# EAGLE design 5977a to pcb adaptor (EAGLE 5.11)
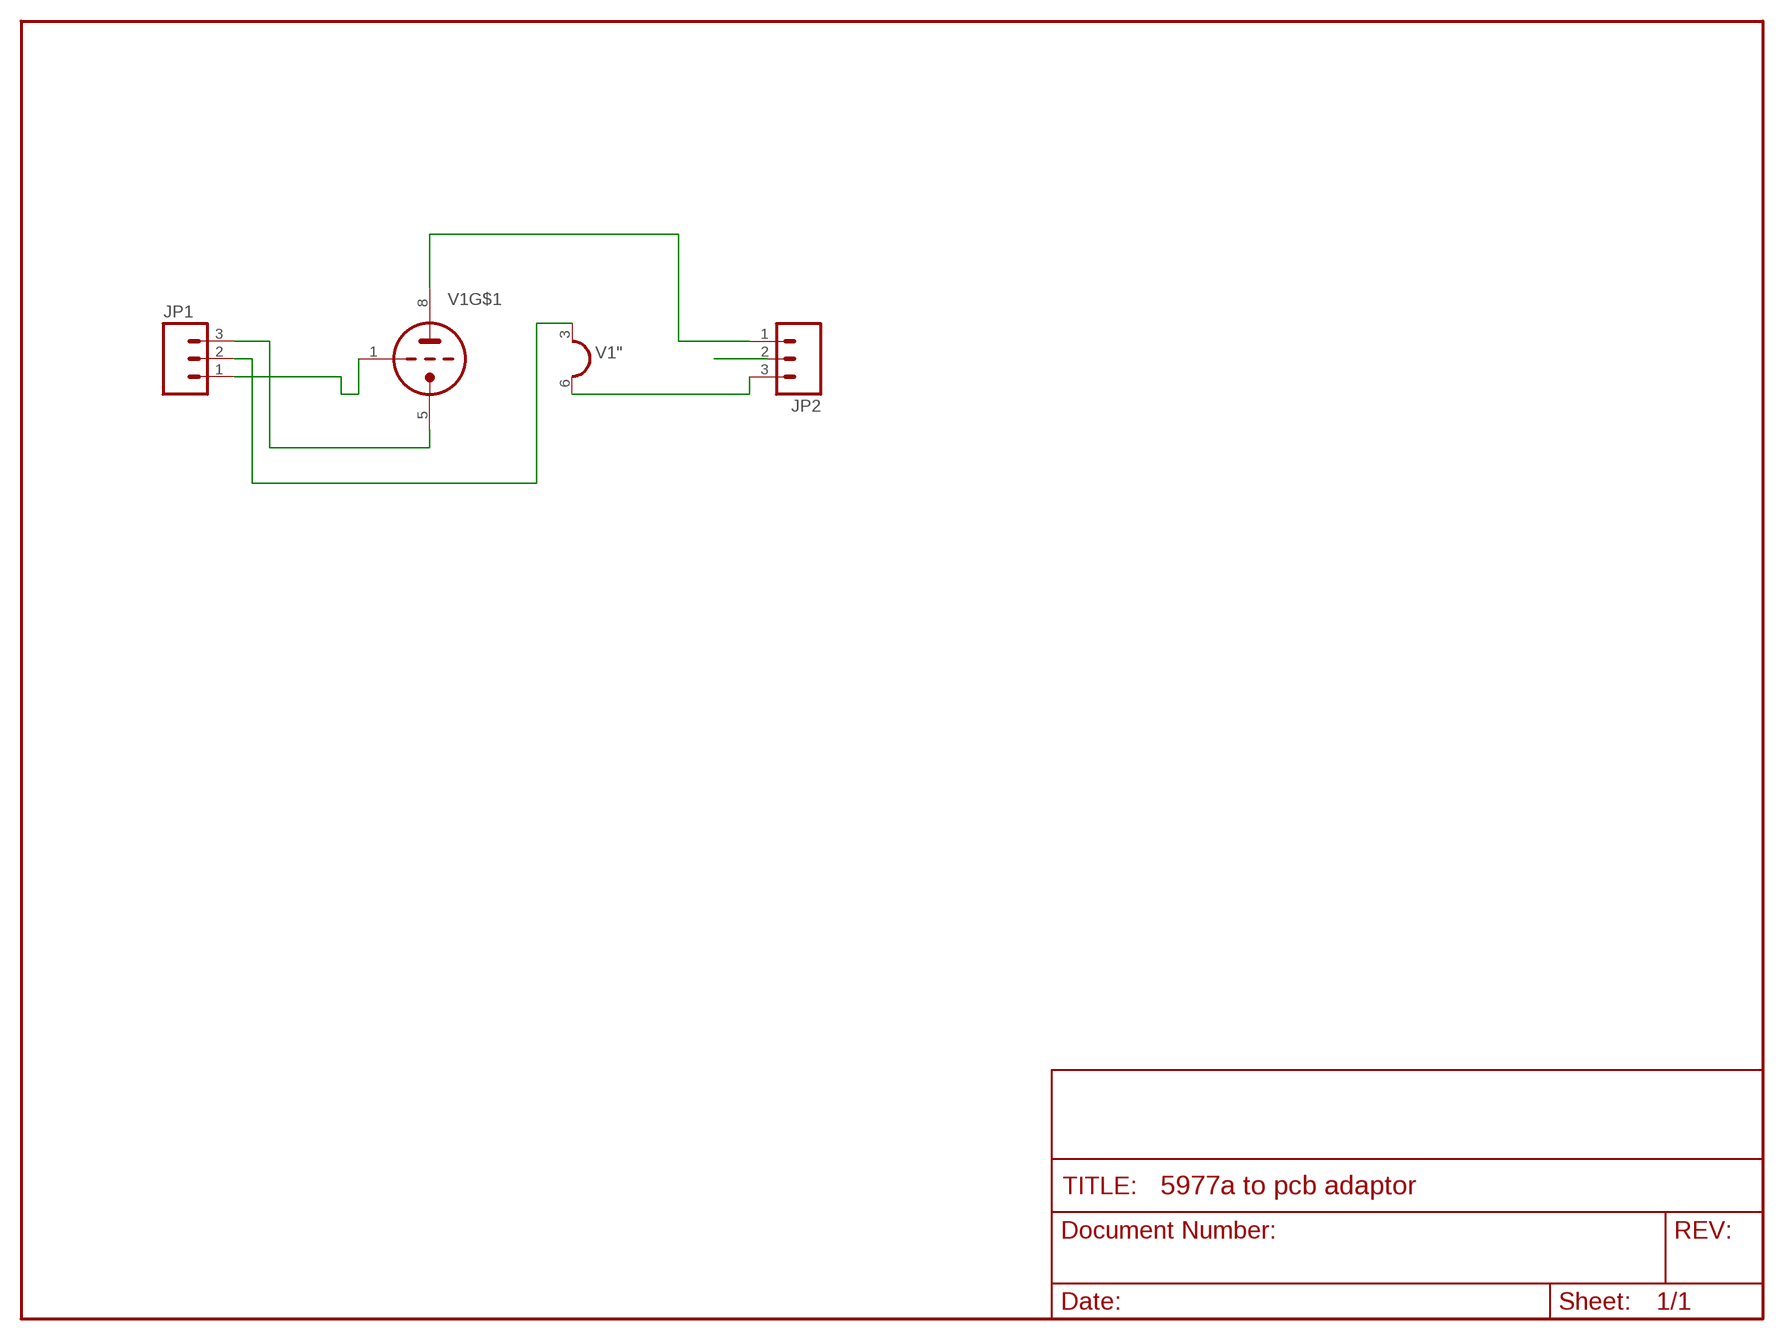
[diagram p0: schematic, sheet 1]

## Parts
JP1  M03PTH  [1X03]
JP2  M03PTH  [1X03]
V1  5977A  [E8-10]

## Nets
CATHODE: JP1.3 V1.5(TK)
HEATER1: JP1.2 V1.3(":H1)
HEATER2: JP2.3 V1.6(":H2)
N$2: JP1.1 V1.1(TG)
PLATE: JP2.1 V1.8(TA)
Unconnected: JP2.2

## Library data of the parts
JP1 JP2 = SparkFun:M03: Header 3 Standard 3-pin 0.1" header. Use with straight break away headers (SKU : PRT-00116), right angle break away headers (PRT-00553), swiss pins (PRT-00743), machine pins (PRT-00117), and female headers (PRT-00115). Molex polarized connector foot print use with SKU : PRT-08232 with associated crimp pins and housings.
V1 = Tubes:5977A

## Board
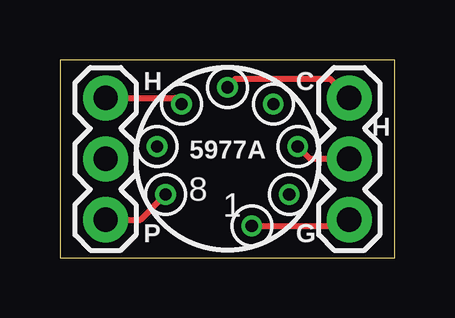
[diagram p1: board, top side]

Size 13.97 x 8.26 mm. Coordinates in mm from the lower left corner, seen from the top.
Outline: 0,0 13.97,0 13.97,8.26 0,8.26 0,0
Copper layers (1*16): Top 0.0356mm / dielectric 1.5011mm / Bottom 0.0356mm
Design rules "LaenPCBOrder": minimum track width 6mil, minimum drill 13mil, track to track 6mil, track to pad 6mil, pad to pad 6mil, via to via 6mil, smd to smd 6mil, copper to edge 15mil, drill to drill 6mil, minimum pad ring 7mil, minimum via ring 7mil, stop-mask expansion 4mil, vias tented up to drill 0mil, thermal gap 10mil

### Footprints (pad centres in the part's own frame; a part is rotated, then mirrored left to right if it is on the bottom)
1X03 = drill 1.016 pad 1.88 round: 1 0,0; 2 2.54,0; 3 5.08,0
E8-10 = drill 0.508 round: 1 1.019,-2.799; 2 2.58,-1.49; 3 2.934,0.517; 4 1.915,2.282; 5 0,2.979; 6 -1.915,2.282; 7 -2.934,0.517; 8 -2.58,-1.49

### Placement (x,y rotation side)
JP1  12.06,1.59 90 top
JP2  1.91,1.59 90 top
V1  6.99,4.13 0 top

### Tracks (layer width: path | path; a pad name or v marks a point on that pad's centre or on a via)
CATHODE
  Top 0.254: V1.5 6.99,7.14 7.32,7.47 11.27,7.47 JP1.3
HEATER1
  Top 0.254: JP1.2 10.44,4.13 V1.3
HEATER2
  Top 0.254: JP2.3 4.81,6.67 V1.6
N$2
  Top 0.254: V1.1 11.81,1.33 JP1.1
PLATE
  Top 0.254: JP2.1 3.35,1.59 V1.8

### Text on the board
tNames: H | C | H | 5977A | P | G